# EAGLE schematic simonSaysModule (EAGLE 9.6.2)
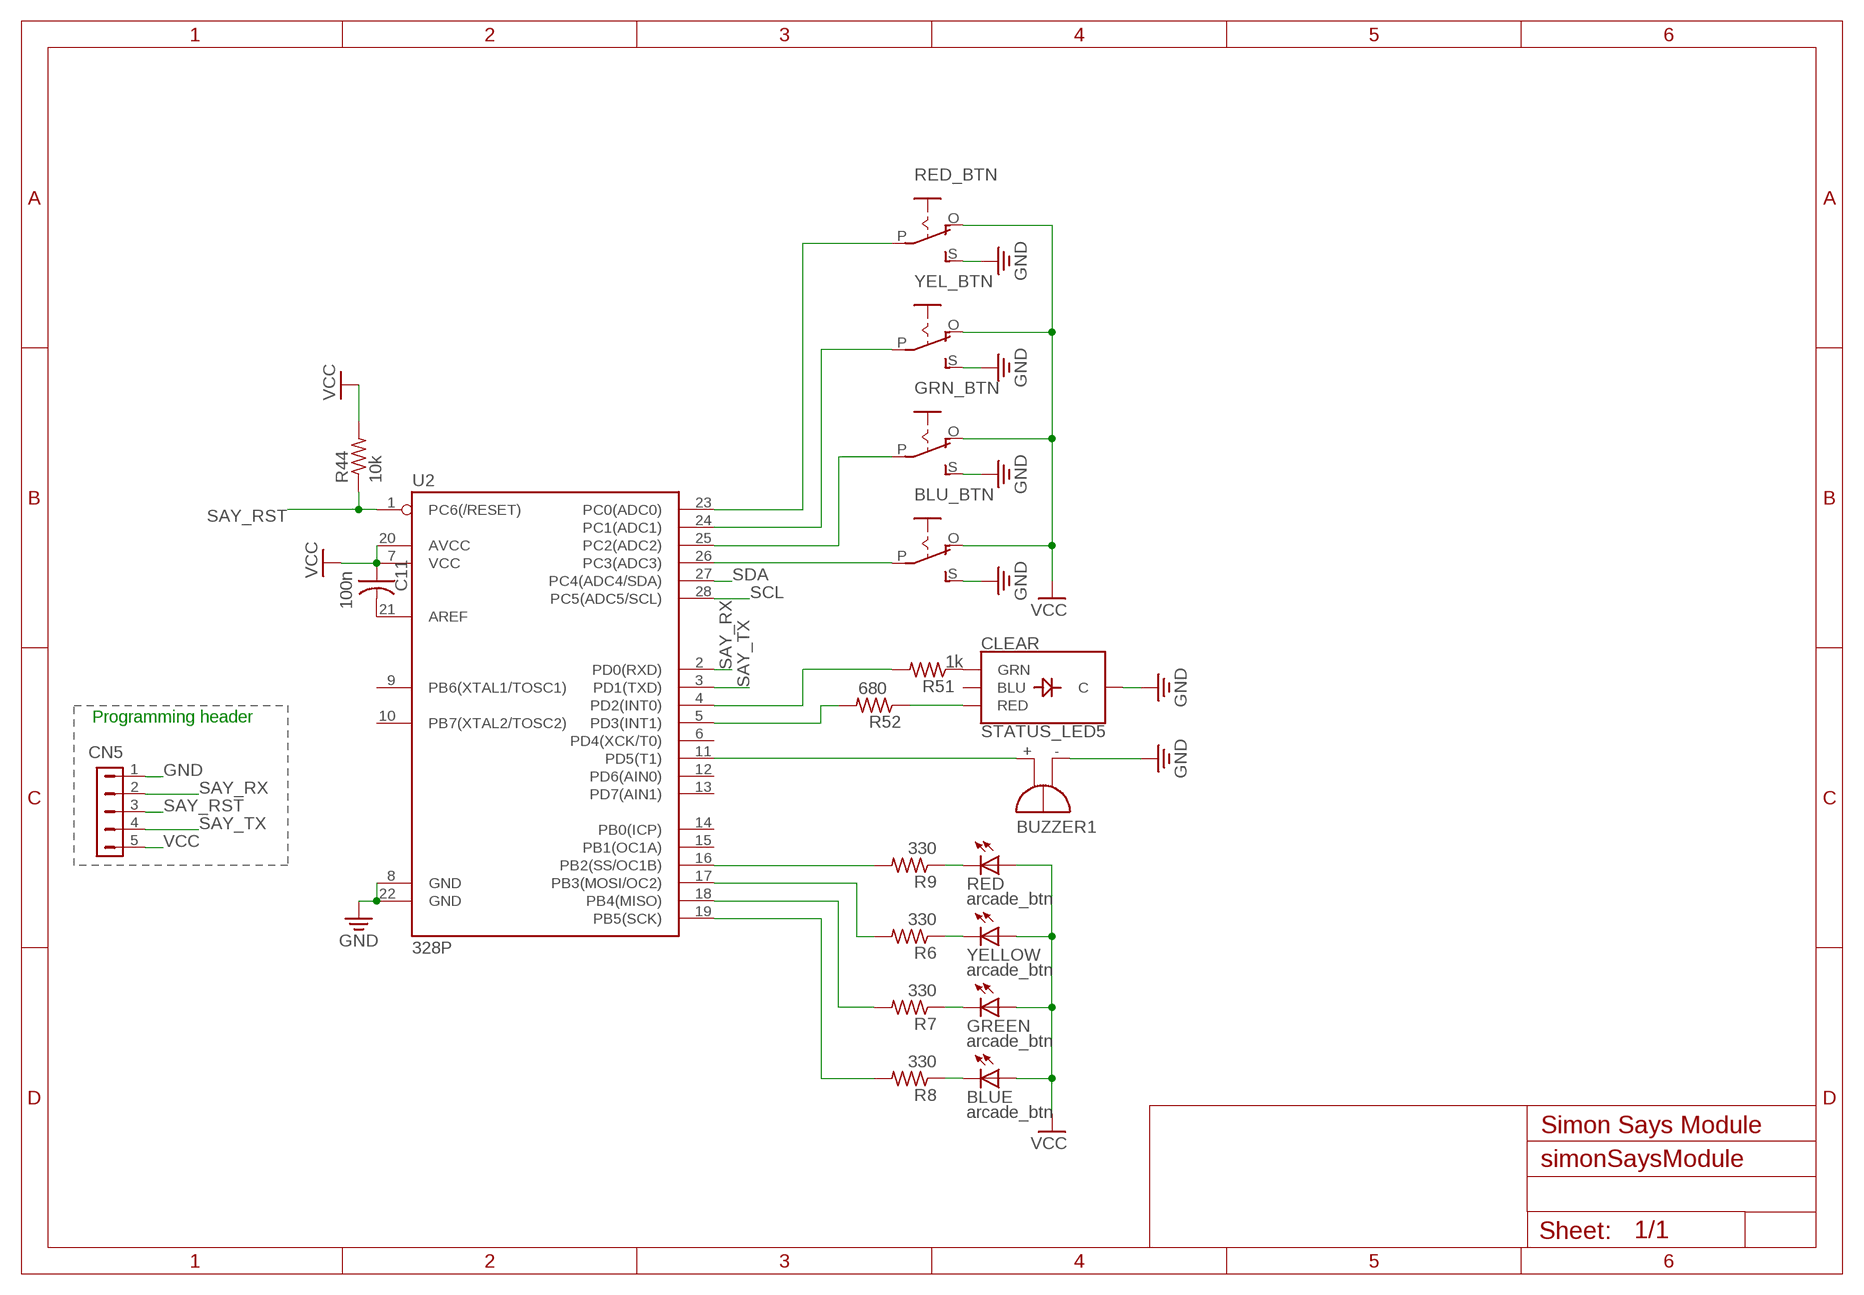
[diagram p0: schematic, sheet 1]

## Parts
BLU_BTN  EG1218S  [EG1218]
BLUE  arcade_btn  LED5MM  [LED5MM]
BUZZER1  EB2209A  [EB2209A]
C11  100n  C-US025-024X044  [C025-024X044]
CN5  HDR-1X5-SIP-100  [SIP-100-5V]
GREEN  arcade_btn  LED5MM  [LED5MM]
GRN_BTN  EG1218S  [EG1218]
R6  330  R-US_0309/12  [0309/12]
R7  330  R-US_0309/12  [0309/12]
R8  330  R-US_0309/12  [0309/12]
R9  330  R-US_0309/12  [0309/12]
R44  10k  R-US_0309/12  [0309/12]
R51  1k  FLIPFLOP-RES  [0805-THM]
R52  680  FLIPFLOP-RES  [0805-THM]
RED  arcade_btn  LED5MM  [LED5MM]
RED_BTN  EG1218S  [EG1218]
STATUS_LED5  CLEAR  LED-RGB-CCCLEAR  [LED-RGB-THRU]
U2  328P  ATMEGA328P_PDIP  [DIP28]
YEL_BTN  EG1218S  [EG1218]
YELLOW  arcade_btn  LED5MM  [LED5MM]

## Nets
GND: BLU_BTN.S BUZZER1.- CN5.1 GRN_BTN.S RED_BTN.S STATUS_LED5.2(C) U2.8(GND) U2.22(GND) YEL_BTN.S
N$33: BUZZER1.+ U2.11(PD5(T1))
N$34: BLU_BTN.P U2.26(PC3(ADC3))
N$35: GRN_BTN.P U2.25(PC2(ADC2))
N$38: U2.24(PC1(ADC1)) YEL_BTN.P
N$39: RED_BTN.P U2.23(PC0(ADC0))
N$43: R6.2 U2.17(PB3(MOSI/OC2))
N$44: BLUE.K(C) R8.1
N$45: GREEN.K(C) R7.1
N$46: R6.1 YELLOW.K(C)
N$47: R9.1 RED.K(C)
N$48: R7.2 R8.2 U2.18(PB4(MISO)) U2.19(PB5(SCK))
N$70: R52.2 U2.5(PD3(INT1))
N$71: R51.2 U2.4(PD2(INT0))
N$116: R9.2 U2.16(PB2(SS/OC1B))
N$139: C11.2 U2.21(AREF)
N$144: R51.1 STATUS_LED5.3(GRN)
N$145: R52.1 STATUS_LED5.1(RED)
SAY_RST: CN5.3 R44.1 U2.1(PC6(/RESET))
SAY_RX: CN5.2 U2.2(PD0(RXD))
SAY_TX: CN5.4 U2.3(PD1(TXD))
SCL: U2.28(PC5(ADC5/SCL))
SDA: U2.27(PC4(ADC4/SDA))
VCC: BLU_BTN.O BLUE.A C11.1 CN5.5 GREEN.A GRN_BTN.O R44.2 RED.A RED_BTN.O U2.7(VCC) U2.20(AVCC) YEL_BTN.O YELLOW.A
Unconnected: STATUS_LED5.4(BLU) U2.6(PD4(XCK/T0)) U2.9(PB6(XTAL1/TOSC1)) U2.10(PB7(XTAL2/TOSC2)) U2.12(PD6(AIN0)) U2.13(PD7(AIN1)) U2.14(PB0(ICP)) U2.15(PB1(OC1A))

## Notes on the sheet
- Programming header
- Simon Says Module

## Library data of the parts
BLU_BTN GRN_BTN RED_BTN YEL_BTN = adafruit:EG1218: SLIDING SWITCH 0.1" spacing through hole, vertical SPDT slide switch http://www.ladyada.net/library/pcb/eaglelibrary.html
BLUE GREEN RED YELLOW = adafruit:LED: LED OSRAM: - CHIPLED LG R971, LG N971, LY N971, LG Q971, LY Q971, LO R971, LY R971 LH N974, LH R974 LS Q976, LO Q976, LY Q976 LO Q996 - Hyper CHIPLED LW Q18S LB Q993, LB Q99A, LB R99A - SideLED LS A670, LO A670, LY A670, LG A670, LP A670 LB A673, LV A673, LT A673, LW A673 LH A674 LY A675 LS A676, LA A676, LO A676, LY A676, LW A676 LS A679, LY A679, LG A679 - Hyper Micro SIDELED® LS Y876, LA Y876, LO Y876, LY Y876 LT Y87S - SmartLED LW L88C, LW L88S LB L89C, LB L89S, LG L890 LS L89K, LO L89K, LY L89K LS L896, LA L896, LO L896, LY L896 - TOPLED LS T670, LO T670, LY T670, LG T670, LP T670 LSG T670, LSP T670, LSY T670, LOP T670, LYG T670 LG T671, LOG T671, LSG T671 LB T673, LV T673, LT T673, LW T673 LH T674 LS T676, LA T676, LO T676, LY T676, LB T676, LH T676, LSB T676, LW T676 LB T67C, LV T67C, LT T67C, LS T67K, LO T67K, LY T67K, LW E67C LS E67B, LA E67B, LO E67B, LY E67B, LB E67C, LV E67C, LT E67C LW T67C LS T679, LY T679, LG T679 LS T770, LO T770, LY T770, LG T770, LP T770 LB T773, LV T773, LT T773, LW T773 LH T774 LS E675, LA E675, LY E675, LS T675 LS T776, LA T776, LO T776, LY T776, LB T776 LHGB T686 LT T68C, LB T68C - Hyper Mini TOPLED® LB M676 - Mini TOPLED Santana® LG M470 LS M47K, LO M47K, LY M47K Source: http://www.osram.convergy.de/
BUZZER1 = buzzer:EB2209A: BUZZER Source: Buerklin; OC_FARNELL: unknown; OC_NEWARK: unknown
C11 = adafruit:C-US: CAPACITOR, American symbol
CN5 = con-hdrs40:HDR-1X5: HEADER CONNECTOR
R6-R9 R44 = adafruit:R-US_: RESISTOR, American symbol
R51 R52 = adafruit:FLIPFLOP-RES: Flip Flop resistor An 0805 resistor inside a standard 1/4W 5% resistor. Makes for easy mods
STATUS_LED5 = SparkFun-LED:LED-RGB-CC: LED-RGB Common Cathode Packages: LED RGB-THRU LED_PIRANHA_5MM SparkFun Products: RGB Diffused Common Cathode- Diffuse <[https://www.sparkfun.com/products/9264]> RGB Diffused Common Cathode - Clear <[https://www.sparkfun.com/products/105]> LED-RGB 5mm Square (Piranha) <[https://www.sparkfun.com/products/11679]>; PROD_ID: DIO-08418
U2 = SparkFun-IC-Microcontroller:ATMEGA328P_PDIP: Atmel 328P Through hole ATMEGA328P uC used in the Arduino 32kb flash, 1k EEPROM, 2k SRAM Datasheet <http://www.sparkfun.com/datasheets/Components/SMD/ATMega328.pdf> SparkFun Products Storefront component: AVR 28 Pin 20MHz 32K 6A/D - ATMega328P <https://www.sparkfun.com/products/9061> (COM-09061) SparkFun Simon Says - Through-Hole Soldering Kit <https://www.sparkfun.com/products/10547> (KIT-10547) SparkFun Learn to Solder - Simon Says <https://www.sparkfun.com/products/13708> (KIT-13708) SparkFun BigTime Watch Kit <https://www.sparkfun.com/products/11734> (KIT-11734) SparkFun ClockIt <https://www.sparkfun.com/products/10930> (KIT-10930) SparkFun Serial Enabled LCD Kit <https://www.sparkfun.com/products/10097> (LCD-10097) SparkFun Simon Tilts - Through Hole Soldering Kit <https://www.sparkfun.com/products/12634> (KIT-12634) SparkFun Frequency Counter Kit <https://www.sparkfun.com/products/10140> (KIT-10140) FabFM Radio Kit <https://www.sparkfun.com/products/11043> (KIT-11043) SparkFun Binary Blaster Kit <https://www.sparkfun.com/products/12037> (KIT-12037) SparkFun Metro-Gnome <https://www.sparkfun.com/products/9236> (KIT-09236) ATmega328 with Arduino Optiboot (Uno) <https://www.sparkfun.com/products/10524> (DEV-10524); PROD_ID: IC-09136